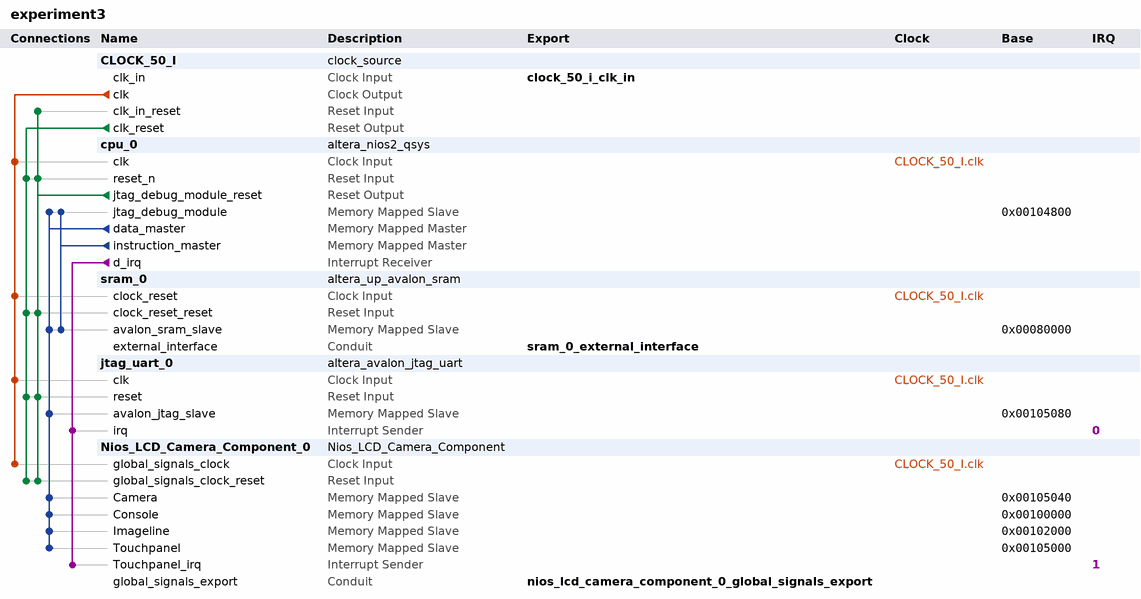
[diagram p0: system contents]
# Platform Designer (Qsys) system experiment3, Cyclone II EP2C35F672C6
# Parameters at their usual value, and those the tool derives, are not listed.
package require -exact qsys 12.0
create_system experiment3
set_project_property DEVICE_FAMILY {Cyclone II}
set_project_property DEVICE EP2C35F672C6

add_instance CLOCK_50_I clock_source 12.0
set_instance_parameter_value CLOCK_50_I clockFrequency 50000000

add_instance cpu_0 altera_nios2_qsys 12.0
set_instance_parameter_value cpu_0 resetSlave sram_0.avalon_sram_slave
set_instance_parameter_value cpu_0 exceptionSlave sram_0.avalon_sram_slave
set_instance_parameter_value cpu_0 breakSlave cpu_0.jtag_debug_module
set_instance_parameter_value cpu_0 impl Tiny
set_instance_parameter_value cpu_0 icache_size 4096

add_instance sram_0 altera_up_avalon_sram 11.0
set_instance_parameter_value sram_0 board DE2
set_instance_parameter_value sram_0 pixel_buffer false

add_instance jtag_uart_0 altera_avalon_jtag_uart 12.0
set_instance_parameter_value jtag_uart_0 simInteractiveOptions INTERACTIVE_ASCII_OUTPUT

add_instance Nios_LCD_Camera_Component_0 Nios_LCD_Camera_Component 1.0

# connections
add_connection CLOCK_50_I.clk cpu_0.clk clock
add_connection CLOCK_50_I.clk jtag_uart_0.clk clock
add_connection CLOCK_50_I.clk Nios_LCD_Camera_Component_0.global_signals_clock clock
add_connection CLOCK_50_I.clk sram_0.clock_reset clock
add_connection CLOCK_50_I.clk_reset cpu_0.reset_n reset
add_connection CLOCK_50_I.clk_reset jtag_uart_0.reset reset
add_connection CLOCK_50_I.clk_reset Nios_LCD_Camera_Component_0.global_signals_clock_reset reset
add_connection CLOCK_50_I.clk_reset sram_0.clock_reset_reset reset
add_connection cpu_0.jtag_debug_module_reset CLOCK_50_I.clk_in_reset reset
add_connection cpu_0.jtag_debug_module_reset cpu_0.reset_n reset
add_connection cpu_0.jtag_debug_module_reset jtag_uart_0.reset reset
add_connection cpu_0.jtag_debug_module_reset Nios_LCD_Camera_Component_0.global_signals_clock_reset reset
add_connection cpu_0.jtag_debug_module_reset sram_0.clock_reset_reset reset
add_connection cpu_0.data_master cpu_0.jtag_debug_module avalon
set_connection_parameter_value cpu_0.data_master/cpu_0.jtag_debug_module baseAddress 0x00104800
add_connection cpu_0.data_master jtag_uart_0.avalon_jtag_slave avalon
set_connection_parameter_value cpu_0.data_master/jtag_uart_0.avalon_jtag_slave baseAddress 0x00105080
add_connection cpu_0.data_master Nios_LCD_Camera_Component_0.Camera avalon
set_connection_parameter_value cpu_0.data_master/Nios_LCD_Camera_Component_0.Camera baseAddress 0x00105040
add_connection cpu_0.data_master Nios_LCD_Camera_Component_0.Console avalon
set_connection_parameter_value cpu_0.data_master/Nios_LCD_Camera_Component_0.Console baseAddress 0x00100000
add_connection cpu_0.data_master Nios_LCD_Camera_Component_0.Imageline avalon
set_connection_parameter_value cpu_0.data_master/Nios_LCD_Camera_Component_0.Imageline baseAddress 0x00102000
add_connection cpu_0.data_master Nios_LCD_Camera_Component_0.Touchpanel avalon
set_connection_parameter_value cpu_0.data_master/Nios_LCD_Camera_Component_0.Touchpanel baseAddress 0x00105000
add_connection cpu_0.data_master sram_0.avalon_sram_slave avalon
set_connection_parameter_value cpu_0.data_master/sram_0.avalon_sram_slave baseAddress 0x00080000
add_connection cpu_0.instruction_master cpu_0.jtag_debug_module avalon
set_connection_parameter_value cpu_0.instruction_master/cpu_0.jtag_debug_module baseAddress 0x00104800
add_connection cpu_0.instruction_master sram_0.avalon_sram_slave avalon
set_connection_parameter_value cpu_0.instruction_master/sram_0.avalon_sram_slave baseAddress 0x00080000
add_connection cpu_0.d_irq jtag_uart_0.irq interrupt
set_connection_parameter_value cpu_0.d_irq/jtag_uart_0.irq irqNumber 0
add_connection cpu_0.d_irq Nios_LCD_Camera_Component_0.Touchpanel_irq interrupt
set_connection_parameter_value cpu_0.d_irq/Nios_LCD_Camera_Component_0.Touchpanel_irq irqNumber 1

# exported interfaces
add_interface clock_50_i_clk_in clock sink
set_interface_property clock_50_i_clk_in EXPORT_OF CLOCK_50_I.clk_in
add_interface nios_lcd_camera_component_0_global_signals_export conduit end
set_interface_property nios_lcd_camera_component_0_global_signals_export EXPORT_OF Nios_LCD_Camera_Component_0.global_signals_export
add_interface sram_0_external_interface conduit end
set_interface_property sram_0_external_interface EXPORT_OF sram_0.external_interface

save_system experiment3.qsys
